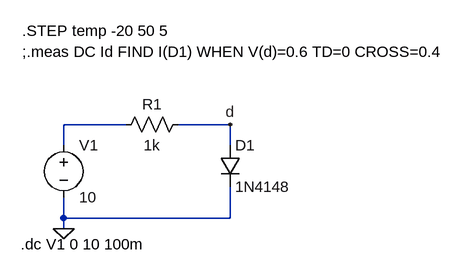
[diagram p0: schematic DE_2024_DIODO_4148.asc]
DE_2024_DIODO_4148.asc, the LTspice schematic file:
Version 4
SHEET 1 880 680
WIRE 128 144 32 144
WIRE 288 144 208 144
WIRE 32 176 32 144
WIRE 288 176 288 144
WIRE 32 288 32 256
WIRE 288 288 288 240
WIRE 288 288 32 288
WIRE 32 304 32 288
FLAG 32 304 0
FLAG 288 144 d
SYMBOL voltage 32 160 R0
SYMATTR InstName V1
SYMATTR Value 10
SYMBOL diode 272 176 R0
SYMATTR InstName D1
SYMATTR Value 1N4148
SYMBOL res 224 128 R90
WINDOW 0 0 56 VBottom 2
WINDOW 3 32 56 VTop 2
SYMATTR InstName R1
SYMATTR Value 1k
TEXT -32 32 Left 2 !;.meas DC Id FIND I(D1) WHEN V(d)=0.6 TD=0 CROSS=0.4
TEXT -32 0 Left 2 !.STEP temp -20 50 5
TEXT -34 328 Left 2 !.dc V1 0 10 100m

The netlist it stands for:
* DE_2024_DIODO_4148.asc
V1 N001 0 10
D1 d 0 1N4148
R1 d N001 1k
.model D D
.lib standard.dio
;.meas DC Id FIND I(D1) WHEN V(d)=0.6 TD=0 CROSS=0.4
.STEP temp -20 50 5
.dc V1 0 10 100m
.backanno
.end